# Altium schematic sheet CSI_DSI.SchDoc
size A4; SheetNumber: 12; SheetTotal: 16
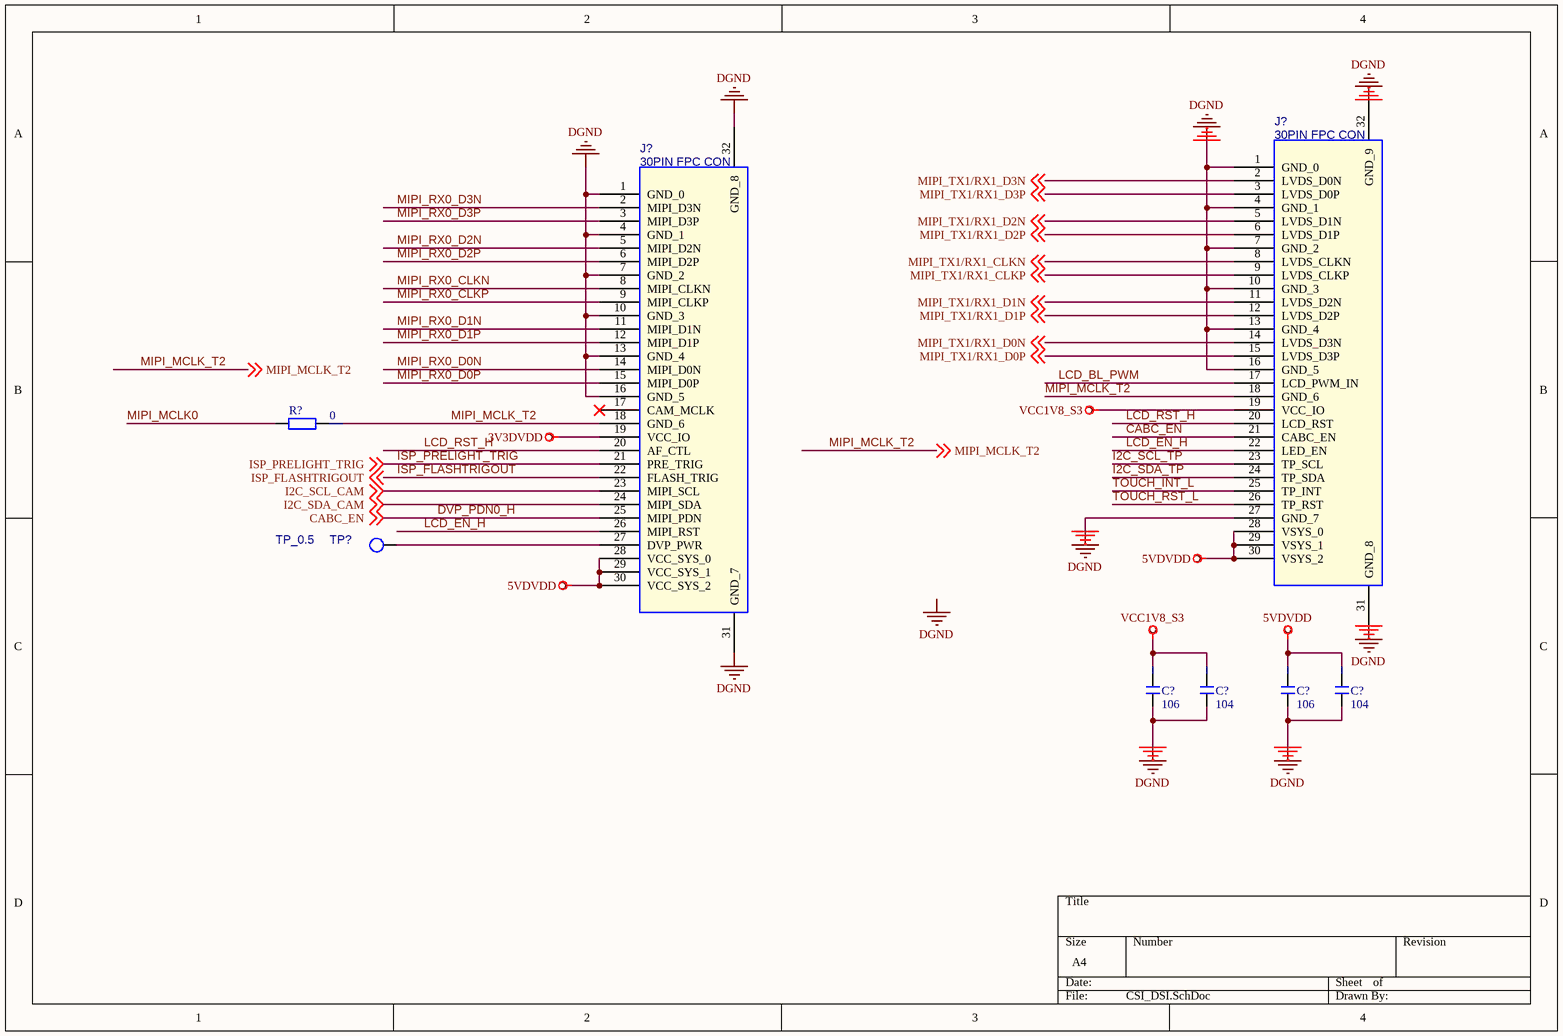
[diagram p0: CSI_DSI.SchDoc]

## Parts
(Parts that share a designator on the sheet are numbered #1, #2 ... from top to bottom, then left to right.)
C?#1  106  [C 0603_L]
C?#2  104  [C 0603_L]
C?#3  106  [C 0603_L]
C?#4  104  [C 0603_L]
J?#1  value 30PIN FPC CON  [FPC1.0-2H-WS-30P]  (hidden comment: LCD_Hitachi_TX05D99VM1AAA_25)
J?#2  value 30PIN FPC CON  [FPC1.0-2H-WS-30P]  (hidden comment: LCD_Hitachi_TX05D99VM1AAA_24)
R?  0  [R 0603_L]
TP?  value TP_0.5  [TEST]  (hidden comment: TP)

## Nets
3V3DVDD: J?#2.19(VCC_IO)
5VDVDD: C?#3.2 C?#4.2 J?#1.28(VSYS_0) J?#1.29(VSYS_1) J?#1.30(VSYS_2) J?#2.28(VCC_SYS_0) J?#2.29(VCC_SYS_1) J?#2.30(VCC_SYS_2)
DGND: C?#1.1 C?#2.1 C?#3.1 C?#4.1 J?#1.1(GND_0) J?#1.4(GND_1) J?#1.7(GND_2) J?#1.10(GND_3) J?#1.13(GND_4) J?#1.16(GND_5) J?#1.27(GND_7) J?#1.31(GND_8) J?#1.32(GND_9) J?#2.1(GND_0) J?#2.4(GND_1) J?#2.7(GND_2) J?#2.10(GND_3) J?#2.13(GND_4) J?#2.16(GND_5) J?#2.31(GND_7) J?#2.32(GND_8)
VCC1V8_S3: C?#1.2 C?#2.2 J?#1.19(VCC_IO)
CABC_EN: J?#1.21(CABC_EN) J?#2.25(MIPI_PDN) ; off-sheet CABC_EN  [also labelled DVP_PDN0_H]
I2C_SCL_CAM: J?#2.23(MIPI_SCL) ; off-sheet I2C_SCL_CAM
I2C_SCL_TP: J?#1.23(TP_SCL)
I2C_SDA_CAM: J?#2.24(MIPI_SDA) ; off-sheet I2C_SDA_CAM
I2C_SDA_TP: J?#1.24(TP_SDA)
ISP_FLASHTRIGOUT: J?#2.22(FLASH_TRIG) ; off-sheet ISP_FLASHTRIGOUT
ISP_PRELIGHT_TRIG: J?#2.21(PRE_TRIG) ; off-sheet ISP_PRELIGHT_TRIG
LCD_BL_PWM: J?#1.17(LCD_PWM_IN)
LCD_EN_H: J?#1.22(LED_EN) J?#2.26(MIPI_RST)
LCD_RST_H: J?#1.20(LCD_RST) J?#2.20(AF_CTL)
MIPI_MCLK0: R?.1
MIPI_MCLK_T2: J?#1.18(GND_6) J?#2.18(GND_6) R?.2 ; off-sheet MIPI_MCLK_T2
MIPI_RX0_CLKN: J?#2.8(MIPI_CLKN)
MIPI_RX0_CLKP: J?#2.9(MIPI_CLKP)
MIPI_RX0_D0N: J?#2.14(MIPI_D0N)
MIPI_RX0_D0P: J?#2.15(MIPI_D0P)
MIPI_RX0_D1N: J?#2.11(MIPI_D1N)
MIPI_RX0_D1P: J?#2.12(MIPI_D1P)
MIPI_RX0_D2N: J?#2.5(MIPI_D2N)
MIPI_RX0_D2P: J?#2.6(MIPI_D2P)
MIPI_RX0_D3N: J?#2.2(MIPI_D3N)
MIPI_RX0_D3P: J?#2.3(MIPI_D3P)
MIPI_TX1/RX1_CLKN: J?#1.8(LVDS_CLKN) ; off-sheet MIPI_TX1/RX1_CLKN
MIPI_TX1/RX1_CLKP: J?#1.9(LVDS_CLKP) ; off-sheet MIPI_TX1/RX1_CLKP
MIPI_TX1/RX1_D0N: J?#1.14(LVDS_D3N) ; off-sheet MIPI_TX1/RX1_D0N
MIPI_TX1/RX1_D0P: J?#1.15(LVDS_D3P) ; off-sheet MIPI_TX1/RX1_D0P
MIPI_TX1/RX1_D1N: J?#1.11(LVDS_D2N) ; off-sheet MIPI_TX1/RX1_D1N
MIPI_TX1/RX1_D1P: J?#1.12(LVDS_D2P) ; off-sheet MIPI_TX1/RX1_D1P
MIPI_TX1/RX1_D2N: J?#1.5(LVDS_D1N) ; off-sheet MIPI_TX1/RX1_D2N
MIPI_TX1/RX1_D2P: J?#1.6(LVDS_D1P) ; off-sheet MIPI_TX1/RX1_D2P
MIPI_TX1/RX1_D3N: J?#1.2(LVDS_D0N) ; off-sheet MIPI_TX1/RX1_D3N
MIPI_TX1/RX1_D3P: J?#1.3(LVDS_D0P) ; off-sheet MIPI_TX1/RX1_D3P
TOUCH_INT_L: J?#1.25(TP_INT)
TOUCH_RST_L: J?#1.26(TP_RST)
NetJ?#2_27: J?#2.27(DVP_PWR) TP?.1

Not connected (* = marked no-connect by the designer): J?#2 17(CAM_MCLK)*

## Notes on the sheet
- Labels drawn without touching a wire or pin: DGND

## Library data of the parts
C?#1-C?#4 = C: 贴片电容
J?#1 = LCD_Hitachi_TX05D99VM1AAA_25: Part Reference: J4702; PCB Footprint: CNN30_1R00_FP05SL_V
J?#2 = LCD_Hitachi_TX05D99VM1AAA_24: Part Reference: J4601; PCB Footprint: CNN30_1R00_FP05SL_V
R? = 0805 电阻: 贴片电阻 0805 电阻; ComponentLink1Description: 供应商链接; ComponentLink1URL: http://www.szlcsc.com/product/details_18165.html; Package: 0805; Supplier: LC; SuppliersPartNumber: C17477
TP? = TP: Test Point 0.5mm; Part Reference: TP4601; PCB Footprint: TP_0R50; Priority: A; RK PN: TESTPOINT_0R5; Created by: CZD; Part Type: TP